# Altium schematic sheet Sheet5.SchDoc
size A
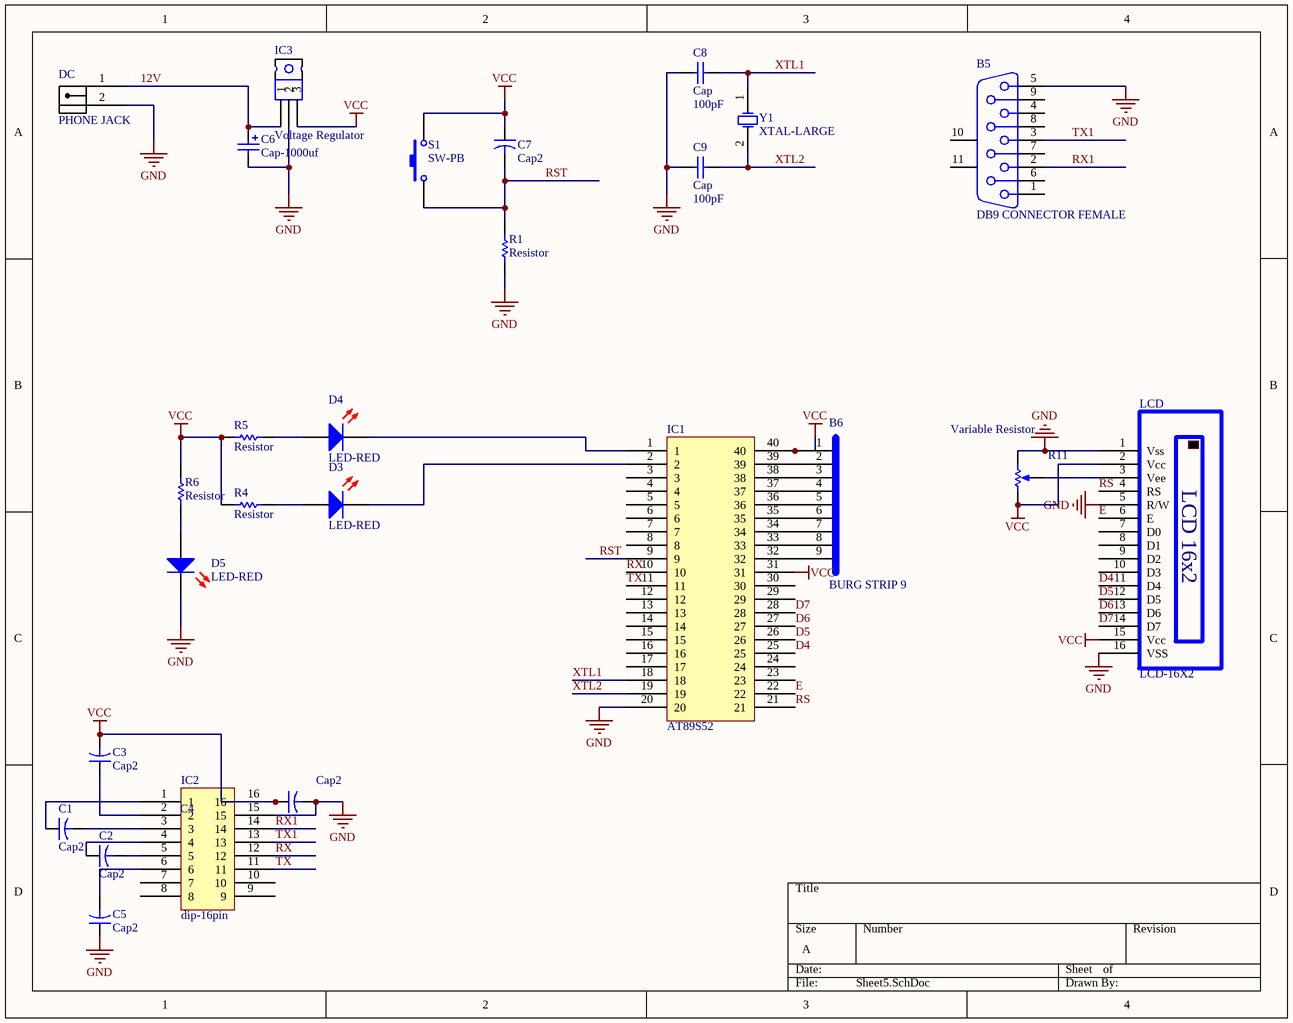
[diagram p0: Sheet5.SchDoc]

## Parts
B5  DB9 CONNECTOR FEMALE  [DB9 CONNECTOR FEMALE]
B6  BURG STRIP 9  [bergstrip-9pin]
C1  Cap2  [CAP-100uf]
C2  Cap2  [CAP-100uf]
C3  Cap2  [CAP-100uf]
C4  Cap2  [CAP-100uf]
C5  Cap2  [CAP-100uf]
C6  Cap-1000uf  [CAP-1000uf]
C7  Cap2  [CAP-100uf]
C8  Cap  value 100pF  [CAP]
C9  Cap  value 100pF  [CAP]
D3  LED-RED  [LED-RED]
D4  LED-RED  [LED-RED]
D5  LED-RED  [LED-RED]
DC  PHONE JACK  [PHONE JACK]
IC1  AT89S52  [AT89S52]
IC2  dip-16pin  [dip-16pin]
IC3  Voltage Regulator  [7805 WITH HEAT-SINK]
LCD  LCD-16X2  [LCD-16x2]
R1  Resistor  [res-2.54x4]
R4  Resistor  [res-2.54x4]
R5  Resistor  [res-2.54x4]
R6  Resistor  [res-2.54x4]
R11  Variable Resistor  [reg-variable]
S1  SW-PB  [sw-pb]
Y1  XTAL-LARGE  [XTAL-LARGE]

## Nets
GND: B5.5 C4.2 C5.1 C6.2 C8.1 C9.1 D5.2(K) DC.2 IC1.20 IC2.15 IC3.2 LCD.1(Vss) LCD.5(R/W) LCD.16(VSS) R1.1 R11.3(BOT)
VCC: B6.1 C3.2 C4.1 C7.1 IC1.31 IC1.40 IC2.16 IC3.3 LCD.2(Vcc) LCD.15(Vcc) R4.1 R5.1 R6.2 R11.1(TOP) S1.2
12V: C6.1 DC.1 IC3.1
D4: IC1.25 LCD.11(D4)
D5: IC1.26 LCD.12(D5)
D6: IC1.27 LCD.13(D6)
D7: IC1.28 LCD.14(D7)
E: IC1.22 LCD.6(E)
RS: IC1.21 LCD.4(RS)
RST: C7.2 IC1.9 R1.2 S1.1
RX: IC1.10 IC2.12
RX1: B5.2 IC2.14
TX: IC1.11 IC2.11
TX1: B5.3 IC2.13
XTL1: C8.2 IC1.18 Y1.1(OSC1)
XTL2: C9.2 IC1.19 Y1.2(OSC2)
NetB6_2: B6.2 IC1.39
NetB6_3: B6.3 IC1.38
NetB6_4: B6.4 IC1.37
NetB6_5: B6.5 IC1.36
NetB6_6: B6.6 IC1.35
NetB6_7: B6.7 IC1.34
NetB6_8: B6.8 IC1.33
NetB6_9: B6.9 IC1.32
NetC1_1: C1.1 IC2.1
NetC1_2: C1.2 IC2.3
NetC2_1: C2.1 IC2.4
NetC2_2: C2.2 IC2.5
NetC3_1: C3.1 IC2.2
NetC5_2: C5.2 IC2.6
NetD3_1: D3.1(A) R4.2
NetD3_2: D3.2(K) IC1.2
NetD4_1: D4.1(A) R5.2
NetD4_2: D4.2(K) IC1.1
NetD5_1: D5.1(A) R6.1
NetLCD_3: LCD.3(Vee) R11.2(TAP)

Not connected (* = marked no-connect by the designer): B5 1 4 6 7 8 9 10(MH1) 11(MH2); IC1 3 4 5 6 7 8 12 13 14 15 16 17 23 24 29 30; IC2 7 8 9 10; LCD 7(D0) 8(D1) 9(D2) 10(D3)

## Notes on the sheet
- (in symbol LCD-16X2) LCD 16x2

## Library data of the parts
C8 C9 = Cap: Capacitor; Published: 8-Jun-2000; LatestRevisionDate: 17-Jul-2002; LatestRevisionNote: Re-released for DXP Platform.; PackageReference: RAD-0.3; Publisher: Altium Limited
D3-D5 = LED-RED: Typical BLUE SiC LED; Published: 8-Jun-2000; LatestRevisionDate: 17-Dec-2003; LatestRevisionNote: PCB Footprint replaced.; DatasheetVersion: 16-Apr-2002; PackageVersion: 16-Apr-2002; PackageReference: 3.5X2.8X1.9; Publisher: Altium Limited
IC3 = 7805 HEATSINK
R1 R4-R6 = Resistor 2.54x4
S1 = SW-PB: Switch; Published: 24-Mar-1999; LatestRevisionDate: 17-Jul-2002; LatestRevisionNote: Re-released for DXP Platform.; PackageReference: SPST-2; Publisher: Altium Limited
Y1 = XTAL-LARGE: Crystal Oscillator; Published: 8-Jun-2000; LatestRevisionDate: 17-Jul-2002; LatestRevisionNote: Re-released for DXP Platform.; PackageReference: R38; Publisher: Altium Limited